# Altium schematic sheet PUMA-10S_V2.1.SchDoc: PUMA 10s (part 2 of 2)
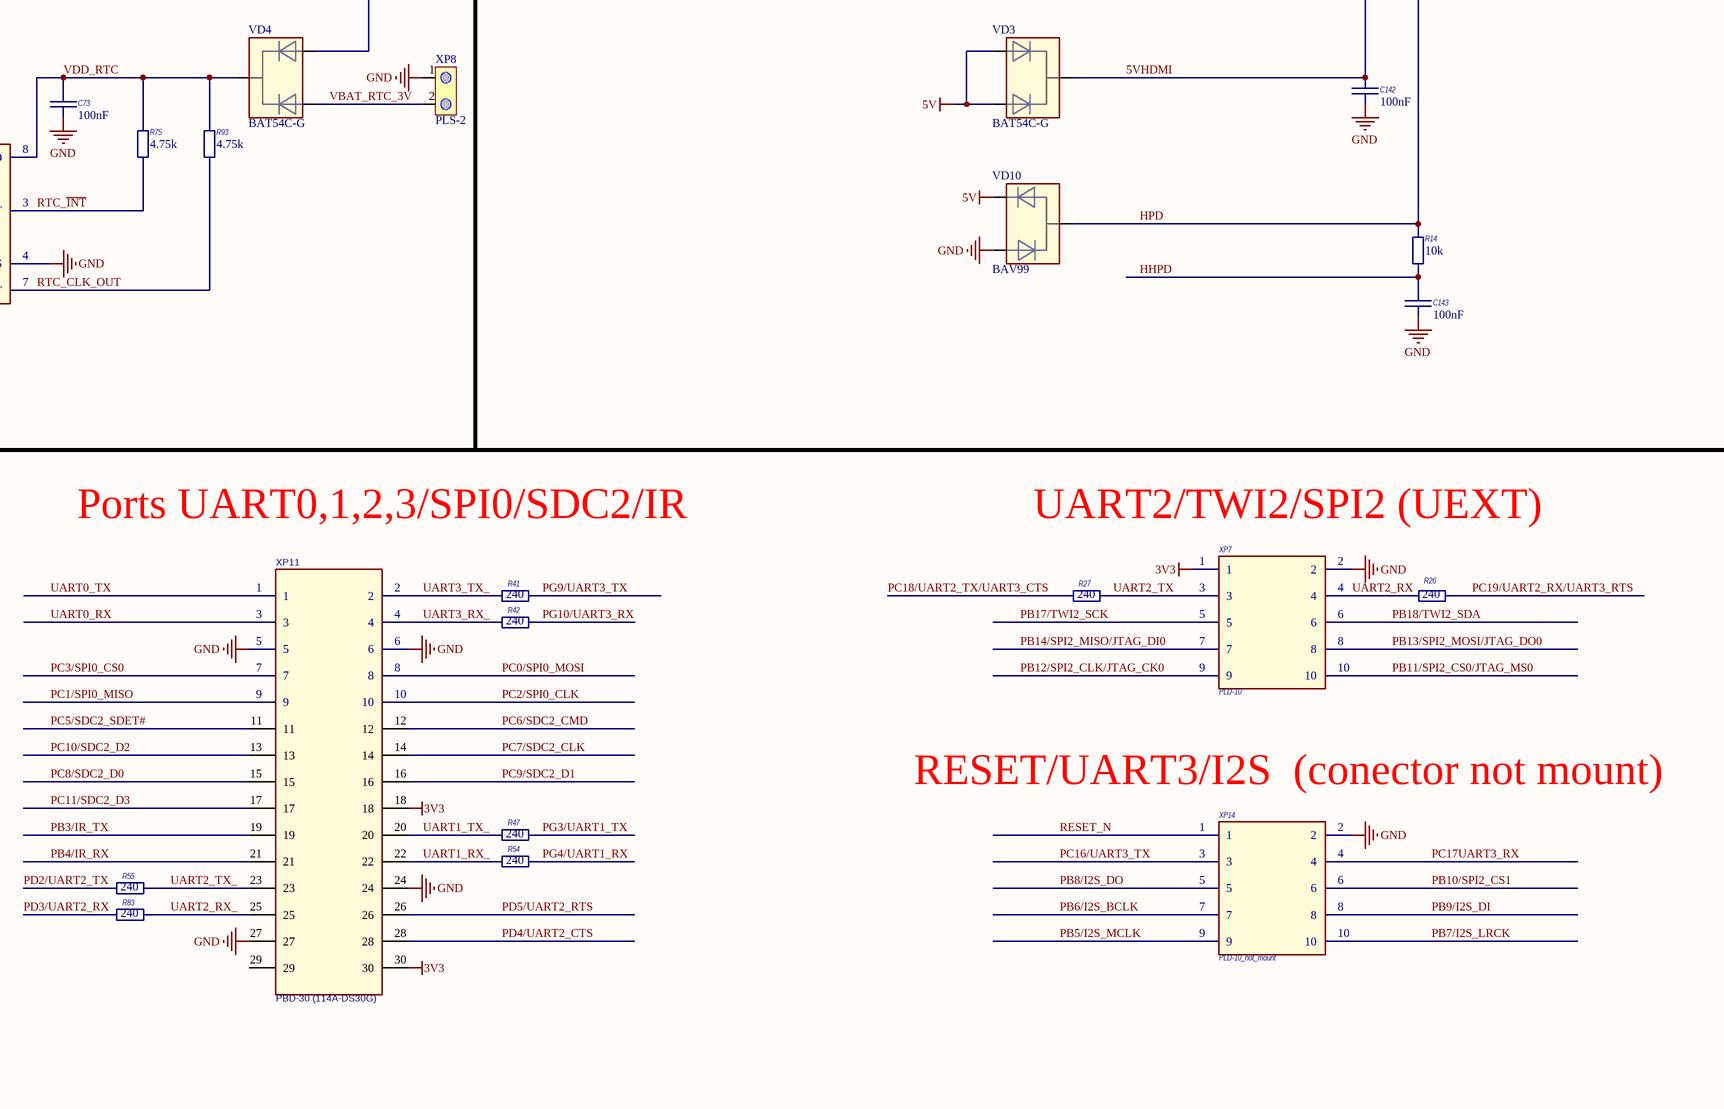
[diagram p9: PUMA-10S_V2.1.SchDoc, bottom right]

## Library data of the parts
BQ1 = FT13A 25.0 MHz: CRYSTAL 25MHZ, 16pF, 50PPM, 3.2x2.5mm
BQ2 = FT13A 24.0 MHz: CRYSTAL 24MHZ, 16pF, 50PPM, 3.2x2.5mm
BQ3 = Crystal Resonator 32.768kHz, 12.5pF 30PPM
BT1 = THAF14: Horizontal Push Tact Switch
C1 C5 C13 C24 C27 C38 C47 C49 C52 C53 C62 C64 C83 C93 C95 C98-C100 C102 C103 C105-C109 C111 C112 C115 C117 C118 C122 C128-C134 C136 C141 = GRM188R60J106ME47: C0603 10uF 6.3V X5R; Manufacturer: Murata Electronics North America; Manufacturer Part Number: GRM188R60J106ME47D; Tolerance: ±20%; Supplier 1: Digi-Key; Supplier Part Number 1: 490-3896-1-ND; RoHS: RoHS Compliant; Package / Case: 0603 (1608 Metric); Packaging: Cut Tape (CT); ComponentLink1URL: http://www.murata.com/products/catalog/pdf/c02e.pdf; ComponentLink1Description: http://www.murata.com/products/catalog/pdf/c02e.pdf; Category: Capacitors; Stock 1: 2049873; Pricing 1: 1=0.24, 10=0.2, 50=0.1126, 100=0.1, 250=0.075, 500=0.06626, 1000=0.05875 (USD); Voltage - Rated: 6.3V; Temperature Coefficient: X5R; Mounting Type: Surface Mount, MLCC; Operating Temperature: -55°C ~ 85°C; Applications: General Purpose; Ratings: -; Size / Dimension: 0.063" L x 0.031" W (1.60mm x 0.80mm); Height - Seated (Max): -; Thickness (Max): 0.035" (0.90mm); Lead Spacing: -; Features: -; Lead Style: -
C2-C4 C6-C12 C14 C15 C18-C23 C25 C26 C28-C37 C39 C40 C42-C46 C50 C51 C54-C61 C65-C70 C72-C77 C79 C81 C82 C84-C90 C94 C96 C104 C110 C120 C121 C126 C127 C142 C143 = GRM155R71C104KA88: C0402, 100nF,  16V, X7R; Manufacturer: MURATA; Manufacturer Part Number: GRM155R71C104KA88D; Capacitance Tolerance: ± 10%; Dielectric Characteristic: X7; Voltage Rating: 16; Capacitor Case Style: 0402 [1005 Metric]; Capacitor Terminals: SMD; SVHC: No SVHC (19-Dec-2012); No. of Pins: 2; Reel Quantity: 10000; Tolerance +: 10%; Supplier 1: Farnell; Supplier Part Number 1: 1118151; RoHS: YES; Stock: 3; Pricing: 10000=0.008593, 30000=0.007991 (GBP); Operating Temperature Min: -55; Operating Temperature Max: 125; Operating Temperature Range: -55°C to +125; Package / Case: 0402; Packaging: Reel; Series: GRM Hi-Cap; Terminal Type: Surface Mount (SMD, SMT); Tolerance -: 10%; Voltage Rating V DC: 16; ComponentLink1URL: http://www.farnell.com/datasheets/4360.pdf; ComponentLink1Description: http://www.farnell.com/datasheets/4360.pdf
C16 C17 = GRM1555C1H150: C0402, 15pF 50V, NP0; Manufacturer: Murata Electronics North America; Manufacturer Part Number: GRM1555C1H150JZ01D; Temperature Coefficient: C0G, NP0; Tolerance: ±5%; Height - Seated (Max): -; Packaging: Cut Tape (CT); Thickness (Max): 0.022" (0.55mm); Lead Style: -; Features: -; Lead Spacing: -; RoHS: RoHS Compliant; Operating Temperature: -55°C ~ 125°C; Supplier: Digi-Key; Applications: General Purpose; Category: Capacitors; Ratings: -; Supplier Part Number: 490-1280-1-ND; Mounting Type: Surface Mount, MLCC; Package / Case: 0402 (1005 Metric); Size / Dimension: 0.039" L x 0.020" W (1.00mm x 0.50mm); ComponentLink1URL: http://search.murata.co.jp/Ceramy/image/img/PDF/ENG/GRM1555C1H150JZ01.pdf; ComponentLink1Description: http://search.murata.co.jp/Ceramy/image/img/PDF/ENG/GRM1555C1H150JZ01.pdf; Pricing: 1=0.1, 10=0.035, 50=0.0188, 100=0.016, 250=0.01304, 500=0.01116, 1000=0.0087, 5000=0.00725 (USD); Voltage - Rated: 50V
C41 C48 C138 = GRM1555C1H150: C0402, 15pF 50V, NP0; Manufacturer Part Number: GRM1555C1H150JZ01D; Manufacturer: Murata Electronics North America; Temperature Coefficient: C0G, NP0; Tolerance: ±5%; Height - Seated (Max): -; Category: Capacitors; Packaging: Cut Tape (CT); RoHS: RoHS Compliant; Supplier Part Number: 490-1280-1-ND; Lead Spacing: -; Size / Dimension: 0.039" L x 0.020" W (1.00mm x 0.50mm); Features: -; Supplier: Digi-Key; Mounting Type: Surface Mount, MLCC; Lead Style: -; Ratings: -; Thickness (Max): 0.022" (0.55mm); Package / Case: 0402 (1005 Metric); Applications: General Purpose; Operating Temperature: -55°C ~ 125°C; ComponentLink1URL: http://search.murata.co.jp/Ceramy/image/img/PDF/ENG/GRM1555C1H150JZ01.pdf; ComponentLink1Description: http://search.murata.co.jp/Ceramy/image/img/PDF/ENG/GRM1555C1H150JZ01.pdf; Pricing: 1=0.1, 10=0.035, 50=0.0188, 100=0.016, 250=0.01304, 500=0.01116, 1000=0.0087, 5000=0.00725 (USD); Voltage - Rated: 50V
C63 C139 = GRM155R71E682KA01: C0402, 6.8nF 5%,  25V, X7R
C78 C80 C91 C92 C123-C125 C140 = GRM21BR61E475KA12: C0805, 4.7uF 10%, 25V, X5R; Manufacturer: Murata Electronics North America; Applications: General Purpose; Category: Capacitors; Operating Temperature: -55°C ~ 85°C; Package / Case: 0805 (2012 Metric); Size / Dimension: 0.079" L x 0.049" W (2.00mm x 1.25mm); Temperature Coefficient: X5R; Tolerance: ±10%; ComponentLink1URL: http://search.murata.co.jp/Ceramy/image/img/PDF/ENG/GRM21BR61C106KE15.pdf; ComponentLink1Description: http://search.murata.co.jp/Ceramy/image/img/PDF/ENG/GRM21BR61C106KE15.pdf; Pricing: 1=0.3, 10=0.25, 50=0.1408, 100=0.1252, 250=0.09392, 500=0.08294, 1000=0.07356 (USD)
  C78 C80: Voltage - Rated: 25V
C97 C101 C137 = GRM1555C1H680JZ01: C0402, 68pF,  50V, C0G; Manufacturer Part Number: GRM1555C1H680JZ01D; Manufacturer: Murata Electronics North America; Temperature Coefficient: C0G, NP0; Tolerance: ±5%; Height - Seated (Max): -; Thickness (Max): 0.022" (0.55mm); Package / Case: 0402 (1005 Metric); Category: Capacitors; Operating Temperature: -55°C ~ 125°C; Size / Dimension: 0.039" L x 0.020" W (1.00mm x 0.50mm); Lead Spacing: -; RoHS: RoHS Compliant; Mounting Type: Surface Mount, MLCC; Voltage - Rated: 50V; Supplier Part Number: 490-1289-1-ND; Applications: General Purpose; Ratings: -; Supplier: Digi-Key; Packaging: Cut Tape (CT); Lead Style: -; Features: -; ComponentLink1URL: http://search.murata.co.jp/Ceramy/image/img/PDF/ENG/GRM1555C1H680JZ01.pdf; ComponentLink1Description: http://search.murata.co.jp/Ceramy/image/img/PDF/ENG/GRM1555C1H680JZ01.pdf; Pricing: 1=0.1, 10=0.035, 50=0.0188, 100=0.016, 250=0.01304, 500=0.01116, 1000=0.0087, 5000=0.00725 (USD); Supplier 1: Digi-Key; Supplier Part Number 1: 490-1289-1-ND
DD1 = A10S-TFBGA336: CPU ARM Cortex-A8 1G
DD2 = RTL8201CP: Single-Port 10/100M Fast Ethernet PHYceiver
DD3 DD6 = H5TQ2G83CFR-H9C: 2Gb DDR3 SDRAM
DD4 = SY6280AAC: Low Loss Power Distribution Switch
DD5 = NCP603SN150T1G: IC 300mA 1.5V CMOS LDO REG; Manufacturer: ON Semiconductor; Manufacturer Part Number: NCP603SN180T1G; Regulator Topology: Positive Fixed; Voltage - Output: 1.8V; Voltage - Input: Up to 6V; Voltage - Dropout (Typical): 0.245V @ 300mA; Number of Regulators: 1; Current - Output: 300mA (Max); Supplier 1: Digi-Key; Supplier Part Number 1: NCP603SN180T1G-ND; RoHS: RoHS Compliant; Category: Integrated Circuits (ICs); Stock: 0; Pricing: 3000=0.19437 (USD); Current - Limit (Min): 300mA; Operating Temperature: -40°C ~ 125°C; Mounting Type: Surface Mount; Package / Case: 6-TSOP (0.059", 1.50mm Width) 5 leads; Supplier Device Package: 5-TSOP; Packaging: Tape & Reel (TR); ComponentLink1URL: http://www.onsemi.com/pub_link/Collateral/NCP603-D.PDF; ComponentLink1Description: http://www.onsemi.com/pub_link/Collateral/NCP603-D.PDF
DD7 = PCF8563T/5: Real-Time Clock (RTC) and calendar
DD8 DD9 = SY8008C: Synchronous Step Down Regulator 1.5MHz, 1.2A
DD10 = MAX809SD: IC SUPERVISOR, RESET THRESHOLD 2.93V
DD11 = NCP3170BDR2G: IC DC/DC Switching Converters 3A 1MHz; Manufacturer 1: ON Semiconductor; Manufacturer Part Number 1: NCP3170ADR2G; Input Voltage MAX: 18 V; Output Voltage: 3.3 V; Switching Frequency: 500 KHz; Input Voltage MIN: 4.5 V; Product Status: New at Mouser; Description 1: DC/DC Switching Converters 3A SWITCHING REGULATOR; Supplier 1: Mouser; Supplier Part Number 1: 863-NCP3170ADR2G; RoHS 1: RoHS Compliant; Category 1: DC/DC Switching Converters; Stock 1: 8090; Pricing 1: 1=0.972, 25=0.933, 100=0.899, 250=0.845, 500=0.821, 1000=0.738, 2000=0.680, 2500=0.680, 5000=0.641, 10000=0.594 (AUD); Output Current: 3 A; Package / Case: SOIC-8; Packaging: Reel; Mounting Style: SMD/SMT; Maximum Operating Temperature: + 85 C; Minimum Operating Temperature: - 40 C; Product Category: .; RoHS - Mouser: Y; Minimum Order Quantity: 1; Reeling: True; ComponentLink1URL: http://www.onsemi.com/pub/Collateral/NCP3170-D.PDF; ComponentLink1Description: http://www.onsemi.com/pub/Collateral/NCP3170-D.PDF
L1 L2 L11 = BLM15PX331SN1: FILTER BLM15 (0402, 1.2A)
L5 L7 = CDRH2D18/HP-3R3N: INDUCTOR 3.3UH 1.3A; Manufacturer: Sumida; Manufacturer Part Number: CDRH2D18/HP-3R3NC; Maximum DC Resistance: 86 mOhms; Shielding: Shielded; Tolerance: 30 %; Case Height: 2 mm; Case Length: 3.2 mm; Test Frequency: 100 kHz; Product Status: Obsolete; Supplier 1: Mouser; RoHS: RoHS Compliant; Category: Fixed Inductors; Stock 1: 0; Dimensions: 3.2 mm W x 3.2 mm L x 2 mm H; Packaging: Reel; Product: SMD Power Inductor; Series: CDRH; Termination Style: SMD/SMT; Case Width: 3.2 mm; Product Category: SMD Power Inductors Shielded; Standard Pack Qty: 1000; RoHS - Mouser: Y; Minimum Order Quantity: 1; Reeling: True; ComponentLink1URL: http://www.mouser.com/ds/2/390/cdrh2d18hp-189473.pdf; ComponentLink1Description: http://www.mouser.com/ds/2/390/cdrh2d18hp-189473.pdf; Supplier Part Number 1: 851-CDRH2D18HP-3R3NC
L12 = SDR0604-2R2ML: INDUCTOR 2.2 UH 2.8A; Manufacturer: BOURNS; Inductance: 2.2; Q Test Frequency: 7.96; Self Resonant Frequency: 79; External Depth: 5.8; Q Factor: 33; Saturation Current Ic: 5.1; External Length / Height: 4.8; Inductance Tolerance: ± 20%; SVHC: No SVHC (18-Jun-2012); No. of Pins: 2; Inductor Case Style: SMD; Q Factor @ Frequency: 33 @ 7.96; Core Material: Ferrite DR/RI; DC Current Rating: 2.8; DC Resistance Max: 0.06; Supplier: Farnell; Manufacturer Part Number: SDR0604-2R2ML; RoHS: YES; Operating Temperature Min: -40; Resonant Frequency: 79; External Width: 5.8; Operating Temperature Max: 125; Test Frequency: 7.96; ComponentLink1URL: http://www.farnell.com/datasheets/608032.pdf; ComponentLink1Description: http://www.farnell.com/datasheets/608032.pdf; Supplier Part Number: 1827998; Supplier 1: Farnell; Supplier Part Number 1: 1827998
LED1 LED2 = FYLS-0603PGC: LED, Pure Green, 0603
R1 R2 = ERJ-2RKF2400X: R0402, 240R 1%; Manufacturer: Panasonic Electronic Components; Manufacturer Part Number: ERJ-2RKF2260X; Temperature Coefficient: ±100ppm/°C; Power (Watts): 0.1W, 1/10W; Package / Case: 0402 (1005 Metric); Tolerance: ±1%; RoHS: RoHS Compliant; Category: Resistors; Packaging: Tape & Reel (TR); ComponentLink1URL: http://industrial.panasonic.com/www-cgi/jvcr13pz.cgi?E+PZ+3+AOA0002+ERJ2RKF2260X+7+WW; ComponentLink1Description: http://industrial.panasonic.com/www-cgi/jvcr13pz.cgi?E+PZ+3+AOA0002+ERJ2RKF2260X+7+WW; Supplier 1: Digi-Key; Stock 1: 70000; Pricing 1: 10000=0.00347, 30000=0.00305, 50000=0.00279, 100000=0.00274 (USD); Composition: Thick Film; Features: -; Supplier Device Package: 0402; Size / Dimension: 0.039" L x 0.020" W (1.00mm x 0.50mm); Height: 0.016" (0.40mm); Number of Terminations: 2; Supplier Part Number 1: P226LTR-ND
R3-R6 R8 R11 R12 R25 R28 R31 R46 R65 R66 R69 R72 R74-R76 R78 R80 R81 R87 R93 = ERJ-2RKF4751X: R0402, 4.75k 1%; Manufacturer: Panasonic Electronic Components; Temperature Coefficient: ±100ppm/°C; Power (Watts): 0.1W, 1/10W; Tolerance: ±1%; Packaging: Cut Tape (CT); Package / Case: 0402 (1005 Metric); Category: Resistors; Manufacturer Part Number: ERJ-2RKF4751X; Supplier Part Number: P4.75KLCT-ND; RoHS: RoHS Compliant; Supplier: Digi-Key; ComponentLink1URL: http://industrial.panasonic.com/www-cgi/jvcr13pz.cgi?E+PZ+3+AOA0002+ERJ2RKF4751X+7+WW; ComponentLink1Description: http://industrial.panasonic.com/www-cgi/jvcr13pz.cgi?E+PZ+3+AOA0002+ERJ2RKF4751X+7+WW; Features: -; Composition: Thick Film; Height: 0.016" (0.40mm); Number of Terminations: 2; Supplier Device Package: 0402; Size / Dimension: 0.039" L x 0.020" W (1.00mm x 0.50mm)
R7 R9 R50-R52 R64 = ERJ-2RKF22R0X: R0402, 22R 1%; Manufacturer 1: PANASONIC; Manufacturer Part Number 1: ERJ2RKF33R2X; Description 1: PANASONIC - ERJ2RKF33R2X - RESISTOR, 0402, 33R2 1%, 0.1W; Power Rating: 100; Voltage Rating: 50; Temperature Coefficient: ± 100; Resistor Element Material: Thick Film; Resistor Case Style: 0402; Resistor Mounting: SMD; Supplier 1: Farnell; Supplier Part Number 1: 2059106; RoHS 1: YES; Stock 1: 10948; Pricing 1: 50=0.016, 100=0.012, 500=0.006, 1000=0.004 (GBP); Resistance Tolerance: ± 1%; ComponentLink1URL: http://www.farnell.com/datasheets/426256.pdf; ComponentLink1Description: http://www.farnell.com/datasheets/426256.pdf; Supplier: Farnell; RoHS: YES; Manufacturer Part Number: ERJ2RKF33R2X; Supplier Part Number: 2059106; Manufacturer: PANASONIC; Pricing: 50=0.016, 100=0.012, 500=0.006, 1000=0.004 (GBP)
R10 R29 R30 R62 R68 R70 = ERJ-2RKF2001X: R0402, 2k 1%; Manufacturer: Panasonic Electronic Components; Temperature Coefficient: ±100ppm/°C; Power (Watts): 0.1W, 1/10W; Tolerance: ±1%; Package / Case: 0402 (1005 Metric); Features: -; Height: 0.016" (0.40mm); Size / Dimension: 0.039" L x 0.020" W (1.00mm x 0.50mm); Category: Resistors; Supplier: Digi-Key; Composition: Thick Film; RoHS: RoHS Compliant; Supplier Part Number: P2.00KLTR-ND; Manufacturer Part Number: ERJ-2RKF2001X; Packaging: Tape & Reel (TR); Number of Terminations: 2; ComponentLink1URL: http://industrial.panasonic.com/www-cgi/jvcr13pz.cgi?E+PZ+3+AOA0002+ERJ2RKF2001X+7+WW; ComponentLink1Description: http://industrial.panasonic.com/www-cgi/jvcr13pz.cgi?E+PZ+3+AOA0002+ERJ2RKF2001X+7+WW; Pricing: 10000=0.00347, 30000=0.00305, 50000=0.00279, 100000=0.00274 (USD)
R13 R24 R33 R48 = CR0402-J/-000GLF not_mount: R0402, 0R not_mount; Supplier 1: Mouser; Supplier Part Number 1: 652-CR0402-J/-000GLF; 0R not_mount: R0402, 0R not_mount
R14 R43-R45 R57-R59 R71 = ERJ-2RKF1002X: R0402, 10k 1%; Manufacturer: Panasonic; Temperature Coefficient: 100 PPM / C; Power Rating: 100 mWatts; Voltage Rating: 50 Volts; Packaging: Reel; Tolerance: 1 %; Package / Case: 0402 (1005 metric); RoHS: RoHS Compliant By Exemption; Supplier: Mouser; Manufacturer Part Number: ERJ-2RKF1002X; Supplier Part Number: 667-ERJ-2RKF1002X; Category: Thick Film Resistors - SMD; Pricing: 1=0.135, 25=0.032, 100=0.024, 250=0.018, 500=0.014, 1000=0.008, 2000=0.007, 5000=0.004 (AUD); Minimum Order Quantity: 1; Product: Thick Film Resistors SMD; Operating Temperature Range: - 55 C to + 155 C; Dimensions: 0.5 mm W x 1 mm L x 0.35 mm H; Reeling: True; Series: ERJ; Product Category: .; Standard Pack Qty: 10000; Termination Style: SMD/SMT; RoHS - Mouser: E; ComponentLink1URL: http://industrial.panasonic.com/www-data/pdf/AOA0000/AOA0000CE2.pdf; ComponentLink1Description: http://industrial.panasonic.com/www-data/pdf/AOA0000/AOA0000CE2.pdf
R15-R19 R26 R27 R41 R42 R47 R54 R55 R83 = ERJ-2RKF2400X: R0402, 240R 1%; Manufacturer: Panasonic Electronic Components; Manufacturer Part Number: ERJ-2RKF2260X; Power (Watts): 0.1W, 1/10W; Temperature Coefficient: ±100ppm/°C; Supplier 1: Digi-Key; RoHS: RoHS Compliant; Category: Resistors; Stock 1: 70000; Pricing 1: 10000=0.00347, 30000=0.00305, 50000=0.00279, 100000=0.00274 (USD); Packaging: Tape & Reel (TR); Composition: Thick Film; Features: -; Tolerance: ±1%; Package / Case: 0402 (1005 Metric); Supplier Device Package: 0402; Size / Dimension: 0.039" L x 0.020" W (1.00mm x 0.50mm); Height: 0.016" (0.40mm); Number of Terminations: 2; ComponentLink1URL: http://industrial.panasonic.com/www-cgi/jvcr13pz.cgi?E+PZ+3+AOA0002+ERJ2RKF2260X+7+WW; ComponentLink1Description: http://industrial.panasonic.com/www-cgi/jvcr13pz.cgi?E+PZ+3+AOA0002+ERJ2RKF2260X+7+WW; Supplier Part Number 1: P226LTR-ND
R20-R23 = ERJ-2RKF49R9X: R0402, 49.9R 1%; Manufacturer: Panasonic; Temperature Coefficient: 100 PPM / C; Voltage Rating: 50 Volts; Power Rating: 100 mWatts; Category: Thick Film Resistors - SMD; Supplier: Mouser; Supplier Part Number: 667-ERJ-2RKF49R9X; Manufacturer Part Number: ERJ-2RKF49R9X; Product Category: .; Minimum Order Quantity: 1; Series: ERJ; Product: Thick Film Resistors SMD; RoHS - Mouser: E; Reeling: True; Packaging: Reel; Termination Style: SMD/SMT; Package / Case: 0402 (1005 metric); Standard Pack Qty: 10000; Tolerance: 1 %; Operating Temperature Range: - 55 C to + 155 C; RoHS: RoHS Compliant By Exemption; Dimensions: 0.5 mm W x 1 mm L x 0.35 mm H; ComponentLink1URL: http://industrial.panasonic.com/www-data/pdf/AOA0000/AOA0000CE2.pdf; ComponentLink1Description: http://industrial.panasonic.com/www-data/pdf/AOA0000/AOA0000CE2.pdf; Pricing: 1=0.135, 25=0.032, 100=0.024, 250=0.018, 500=0.014, 1000=0.008, 2000=0.007, 5000=0.004 (AUD)
R32 R34 = ERJ-2RKF1002X: R0402, 10k 1%; Manufacturer: Panasonic; Voltage Rating: 50 Volts; Temperature Coefficient: 100 PPM / C; Power Rating: 100 mWatts; Termination Style: SMD/SMT; Series: ERJ; Tolerance: 1 %; Packaging: Reel; Product: Thick Film Resistors SMD; Package / Case: 0402 (1005 metric); Category: Thick Film Resistors - SMD; Manufacturer Part Number: ERJ-2RKF1002X; Operating Temperature Range: - 55 C to + 155 C; Supplier Part Number: 667-ERJ-2RKF1002X; Dimensions: 0.5 mm W x 1 mm L x 0.35 mm H; RoHS: RoHS Compliant By Exemption; Supplier: Mouser; Standard Pack Qty: 10000; RoHS - Mouser: E; Minimum Order Quantity: 1; Product Category: .; Reeling: True; ComponentLink1URL: http://industrial.panasonic.com/www-data/pdf/AOA0000/AOA0000CE2.pdf; ComponentLink1Description: http://industrial.panasonic.com/www-data/pdf/AOA0000/AOA0000CE2.pdf; Pricing: 1=0.135, 25=0.032, 100=0.024, 250=0.018, 500=0.014, 1000=0.008, 2000=0.007, 5000=0.004 (AUD)
R35-R40 R60 R61 R85 R92 = ERJ-2RKF1002X: R0402, 10k 1%; Manufacturer: Panasonic; Power Rating: 100 mWatts; Voltage Rating: 50 Volts; Temperature Coefficient: 100 PPM / C; Minimum Order Quantity: 1; Supplier Part Number: 667-ERJ-2RKF1002X; Packaging: Reel; Product: Thick Film Resistors SMD; Package / Case: 0402 (1005 metric); Category: Thick Film Resistors - SMD; Supplier: Mouser; Manufacturer Part Number: ERJ-2RKF1002X; RoHS: RoHS Compliant By Exemption; Operating Temperature Range: - 55 C to + 155 C; Dimensions: 0.5 mm W x 1 mm L x 0.35 mm H; Reeling: True; Series: ERJ; Product Category: .; Standard Pack Qty: 10000; Termination Style: SMD/SMT; Tolerance: 1 %; RoHS - Mouser: E; ComponentLink1URL: http://industrial.panasonic.com/www-data/pdf/AOA0000/AOA0000CE2.pdf; ComponentLink1Description: http://industrial.panasonic.com/www-data/pdf/AOA0000/AOA0000CE2.pdf; Pricing: 1=0.135, 25=0.032, 100=0.024, 250=0.018, 500=0.014, 1000=0.008, 2000=0.007, 5000=0.004 (AUD)
R49 = ERJ-2RKF2213X: R0402, 221k 1%; Manufacturer: Panasonic Electronic Components; Temperature Coefficient: ±100ppm/°C; Power (Watts): 0.1W, 1/10W; Supplier 1: Digi-Key; Supplier Device Package: 0402; Packaging: Cut Tape (CT); Size / Dimension: 0.039" L x 0.020" W (1.00mm x 0.50mm); Package / Case: 0402 (1005 Metric); Number of Terminations: 2; Height: 0.016" (0.40mm); Supplier: Digi-Key; RoHS: RoHS Compliant; Manufacturer Part Number: ERJ-2RKF2213X; Category: Resistors; Tolerance: ±1%; Features: -; Composition: Thick Film; ComponentLink1URL: http://industrial.panasonic.com/www-cgi/jvcr13pz.cgi?E+PZ+3+AOA0002+ERJ2RKF1202X+7+WW; ComponentLink1Description: http://industrial.panasonic.com/www-cgi/jvcr13pz.cgi?E+PZ+3+AOA0002+ERJ2RKF1202X+7+WW; Pricing: 1=0.1, 50=0.0242, 100=0.0184, 250=0.01364, 500=0.01008, 1000=0.00672, 5000=0.00473 (USD); Supplier Part Number 1: P12.0KLCT-ND; Supplier Part Number: P12.0KLCT-ND; Supplier 2: Farnell; Supplier Part Number 2: 2302875
R53 R63 R67 R73 R77 R82 R88 = ERJ-2RKF1051X: R0402, 1.05k 1%; Manufacturer: Panasonic Electronic Components; Manufacturer Part Number: ERJ-2RKF1001X; Temperature Coefficient: 100 PPM / C; Power Rating: 100 mWatts; Voltage Rating: 50 Volts; Supplier: Mouser; Termination Style: SMD/SMT; Series: ERJ; Supplier Part Number: 667-ERJ-2RKF1001X; RoHS: RoHS Compliant By Exemption; Dimensions: 0.5 mm W x 1 mm L x 0.35 mm H; Package / Case: 0402 (1005 metric); Product Category: .; Packaging: Reel; Tolerance: 1 %; Operating Temperature Range: - 55 C to + 155 C; Category: Thick Film Resistors - SMD; Product: Thick Film Resistors SMD; Reeling: True; Minimum Order Quantity: 1; RoHS - Mouser: E; Standard Pack Qty: 10000; ComponentLink1URL: http://industrial.panasonic.com/www-data/pdf/AOA0000/AOA0000CE2.pdf; ComponentLink1Description: http://industrial.panasonic.com/www-data/pdf/AOA0000/AOA0000CE2.pdf; Pricing: 1=0.135, 25=0.032, 100=0.024, 250=0.018, 500=0.014, 1000=0.008, 2000=0.007, 5000=0.004 (AUD)
R56 = ERJ-2GEJ1R0X: R0402, 1R 5%; Manufacturer Part Number: ERJ-2GEJ101X; Manufacturer: Panasonic Electronic Components; Temperature Coefficient: ±200ppm/°C; Power (Watts): 0.1W, 1/10W; Supplier Part Number: P100JTR-ND; Supplier: Digi-Key; Category: Resistors; Features: -; Composition: Thick Film; Package / Case: 0402 (1005 Metric); Tolerance: ±5%; Height: 0.016" (0.40mm); Number of Terminations: 2; RoHS: RoHS Compliant; Size / Dimension: 0.039" L x 0.020" W (1.00mm x 0.50mm); Packaging: Tape & Reel (TR); ComponentLink1URL: http://industrial.panasonic.com/www-cgi/jvcr13pz.cgi?E+PZ+3+AOA0001+ERJ2GEJ101X+7+WW; ComponentLink1Description: http://industrial.panasonic.com/www-cgi/jvcr13pz.cgi?E+PZ+3+AOA0001+ERJ2GEJ101X+7+WW; Pricing: 10000=0.00248, 30000=0.00218, 50000=0.002, 100000=0.00195 (USD)
R79 = ERJ-2RKF6041X: R0402, 6.04k 1%; Manufacturer: Panasonic Electronic Components; Temperature Coefficient: ±100ppm/°C; Power (Watts): 0.1W, 1/10W; Description 1: RES 6.04K OHM 1/10W 1% 0402 SMD; Category 1: Resistors; Package / Case: 0402 (1005 Metric); Features: -; Tolerance: ±1%; Composition: Thick Film; Height: 0.016" (0.40mm); Number of Terminations: 2; Packaging: Cut Tape (CT); Size / Dimension: 0.039" L x 0.020" W (1.00mm x 0.50mm); Category: Resistors; Manufacturer Part Number: ERJ-2RKF6041X; RoHS: RoHS Compliant; Supplier: Digi-Key; ComponentLink1URL: http://industrial.panasonic.com/www-cgi/jvcr13pz.cgi?E+PZ+3+AOA0002+ERJ2RKF6041X+7+WW; ComponentLink1Description: http://industrial.panasonic.com/www-cgi/jvcr13pz.cgi?E+PZ+3+AOA0002+ERJ2RKF6041X+7+WW; Supplier Part Number: P6.04KLCT-ND; Supplier 1: Digi-Key; Supplier Part Number 1: P6.04KLCT-ND; Manufacturer 1: Panasonic Electronic Components; Manufacturer Part Number 1: ERJ-2RKF6041X; RoHS 1: RoHS Compliant; Stock 1: 566346; Pricing 1: 1=0.1, 50=0.0242, 100=0.0184, 250=0.01364, 500=0.01008, 1000=0.00672, 5000=0.00473 (USD); Pricing: 1=0.1, 50=0.0242, 100=0.0184, 250=0.01364, 500=0.01008, 1000=0.00672, 5000=0.00473 (USD)
R90 = ERJ-2RKF9090X: R0402, 909R 1%; Voltage Rating: 50 Volts; Tolerance: 1 %
VD1 VD2 = RCLAMP0524P: Ultra Low Capacitance TVS Arrays
VD3-VD5 = BAT54C-G: DIODE SCHOTTKY  200mA 30V SOT23
VD6 = 1SMA18AT3: DIODE TVS 18V 400W SMA; Manufacturer: ON Semiconductor; Manufacturer Part Number: 1SMA18AT3G; Breakdown Voltage: 20 V; Clamping Voltage: 29.2 V; Channels: 1 Channel; Peak Surge Current: 13.7 A; Polarity: Unidirectional; Supplier 1: Mouser; RoHS: RoHS Compliant; Category: TVS Diodes - Transient Voltage Suppressors; Stock 1: 6; Pricing 1: 1=0.581, 10=0.389, 100=0.217, 1000=0.162, 5000=0.140, 10000=0.131, 25000=0.120, 50000=0.116, 100000=0.111 (AUD); Dimensions: 2.6 mm W x 4.32 mm L; Operating Voltage: 18 V; Package / Case: SMA; Packaging: Reel; Series: 1SMA5.0AT3; Termination Style: SMD/SMT; Maximum Operating Temperature: + 150 C; Minimum Operating Temperature: - 65 C; Peak Pulse Power Dissipation: 400 W; Product Category: Diodes- TVS; Standard Pack Qty: 5000; RoHS - Mouser: Y; Minimum Order Quantity: 1; Reeling: True; ComponentLink1URL: http://www.mouser.com/ds/2/308/1SMA5.0AT3-D-43155.pdf; ComponentLink1Description: http://www.mouser.com/ds/2/308/1SMA5.0AT3-D-43155.pdf; Supplier Part Number 1: 863-1SMA18AT3G
VD7-VD14 = BAV99: High-speed switching diodes, SOT23
XP1 XP3 = PJ320D: SMT Female 3.5mm Headphone Jacks
XP2 = USB_A_VERTICAL: USB_A_VERTICAL, Right Angle Single Port
XP4 = MINI USB, R/A, SMT, B TYPE
XP5 = 10029449-001RLF: HDMI Connectors
XP6 = RCJ-044: RCA Jack Connector, Yellow
XP7 XP14 = PLD-10: Connector PLD-10
XP8 = PLS-2: Connector PLS-2 (2.54mm x1)
XP9 = PLS-4: Connector PLS-4 (2.54mm x1)
XP10 = PBD-40: Connector PBD-40
XP11 = PBD-30: Connector PBD-30
XP13 = PJ-002BH-SMT: 2.5 mm Center Pin, 5.0 A, Right Angle, Surface Mount (SMT), Dc Power Jack Connector
XS1 = HR911105A: Single Port RJ45 connector with magnetics module and LED
XS2 = microSD: Connector microSD Push-push Type